# EAGLE schematic BR-Master-v1.0 (EAGLE 5.03)
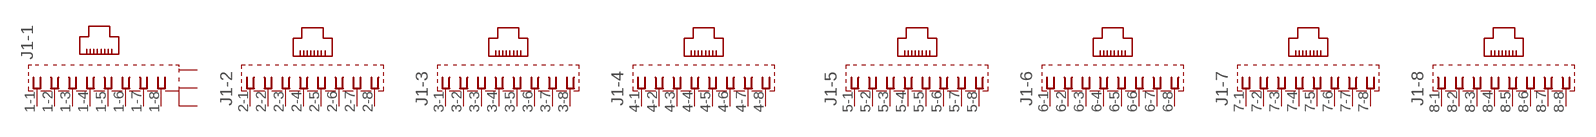
[diagram p0: schematic, sheet 1]

## Parts
J1  557573-1  [557573-1]
Unconnected: J1.1-1 J1.1-2 J1.1-3 J1.1-4 J1.1-5 J1.1-6 J1.1-7 J1.1-8 J1.2-1 J1.2-2 J1.2-3 J1.2-4 J1.2-5 J1.2-6 J1.2-7 J1.2-8 J1.3-1 J1.3-2 J1.3-3 J1.3-4 J1.3-5 J1.3-6 J1.3-7 J1.3-8 J1.4-1 J1.4-2 J1.4-3 J1.4-4 J1.4-5 J1.4-6 J1.4-7 J1.4-8 J1.5-1 J1.5-2 J1.5-3 J1.5-4 J1.5-5 J1.5-6 J1.5-7 J1.5-8 J1.6-1 J1.6-2 J1.6-3 J1.6-4 J1.6-5 J1.6-6 J1.6-7 J1.6-8 J1.7-1 J1.7-2 J1.7-3 J1.7-4 J1.7-5 J1.7-6 J1.7-7 J1.7-8 J1.8-1 J1.8-2 J1.8-3 J1.8-4 J1.8-5 J1.8-6 J1.8-7 J1.8-8 J1.G1 J1.G2 J1.G3

## Library data of the parts
J1 = con-amp:557573-1: AMP connector